# Altium schematic sheet Lan.SchDoc
size A3; SheetNumber: 12; SheetTotal: 22
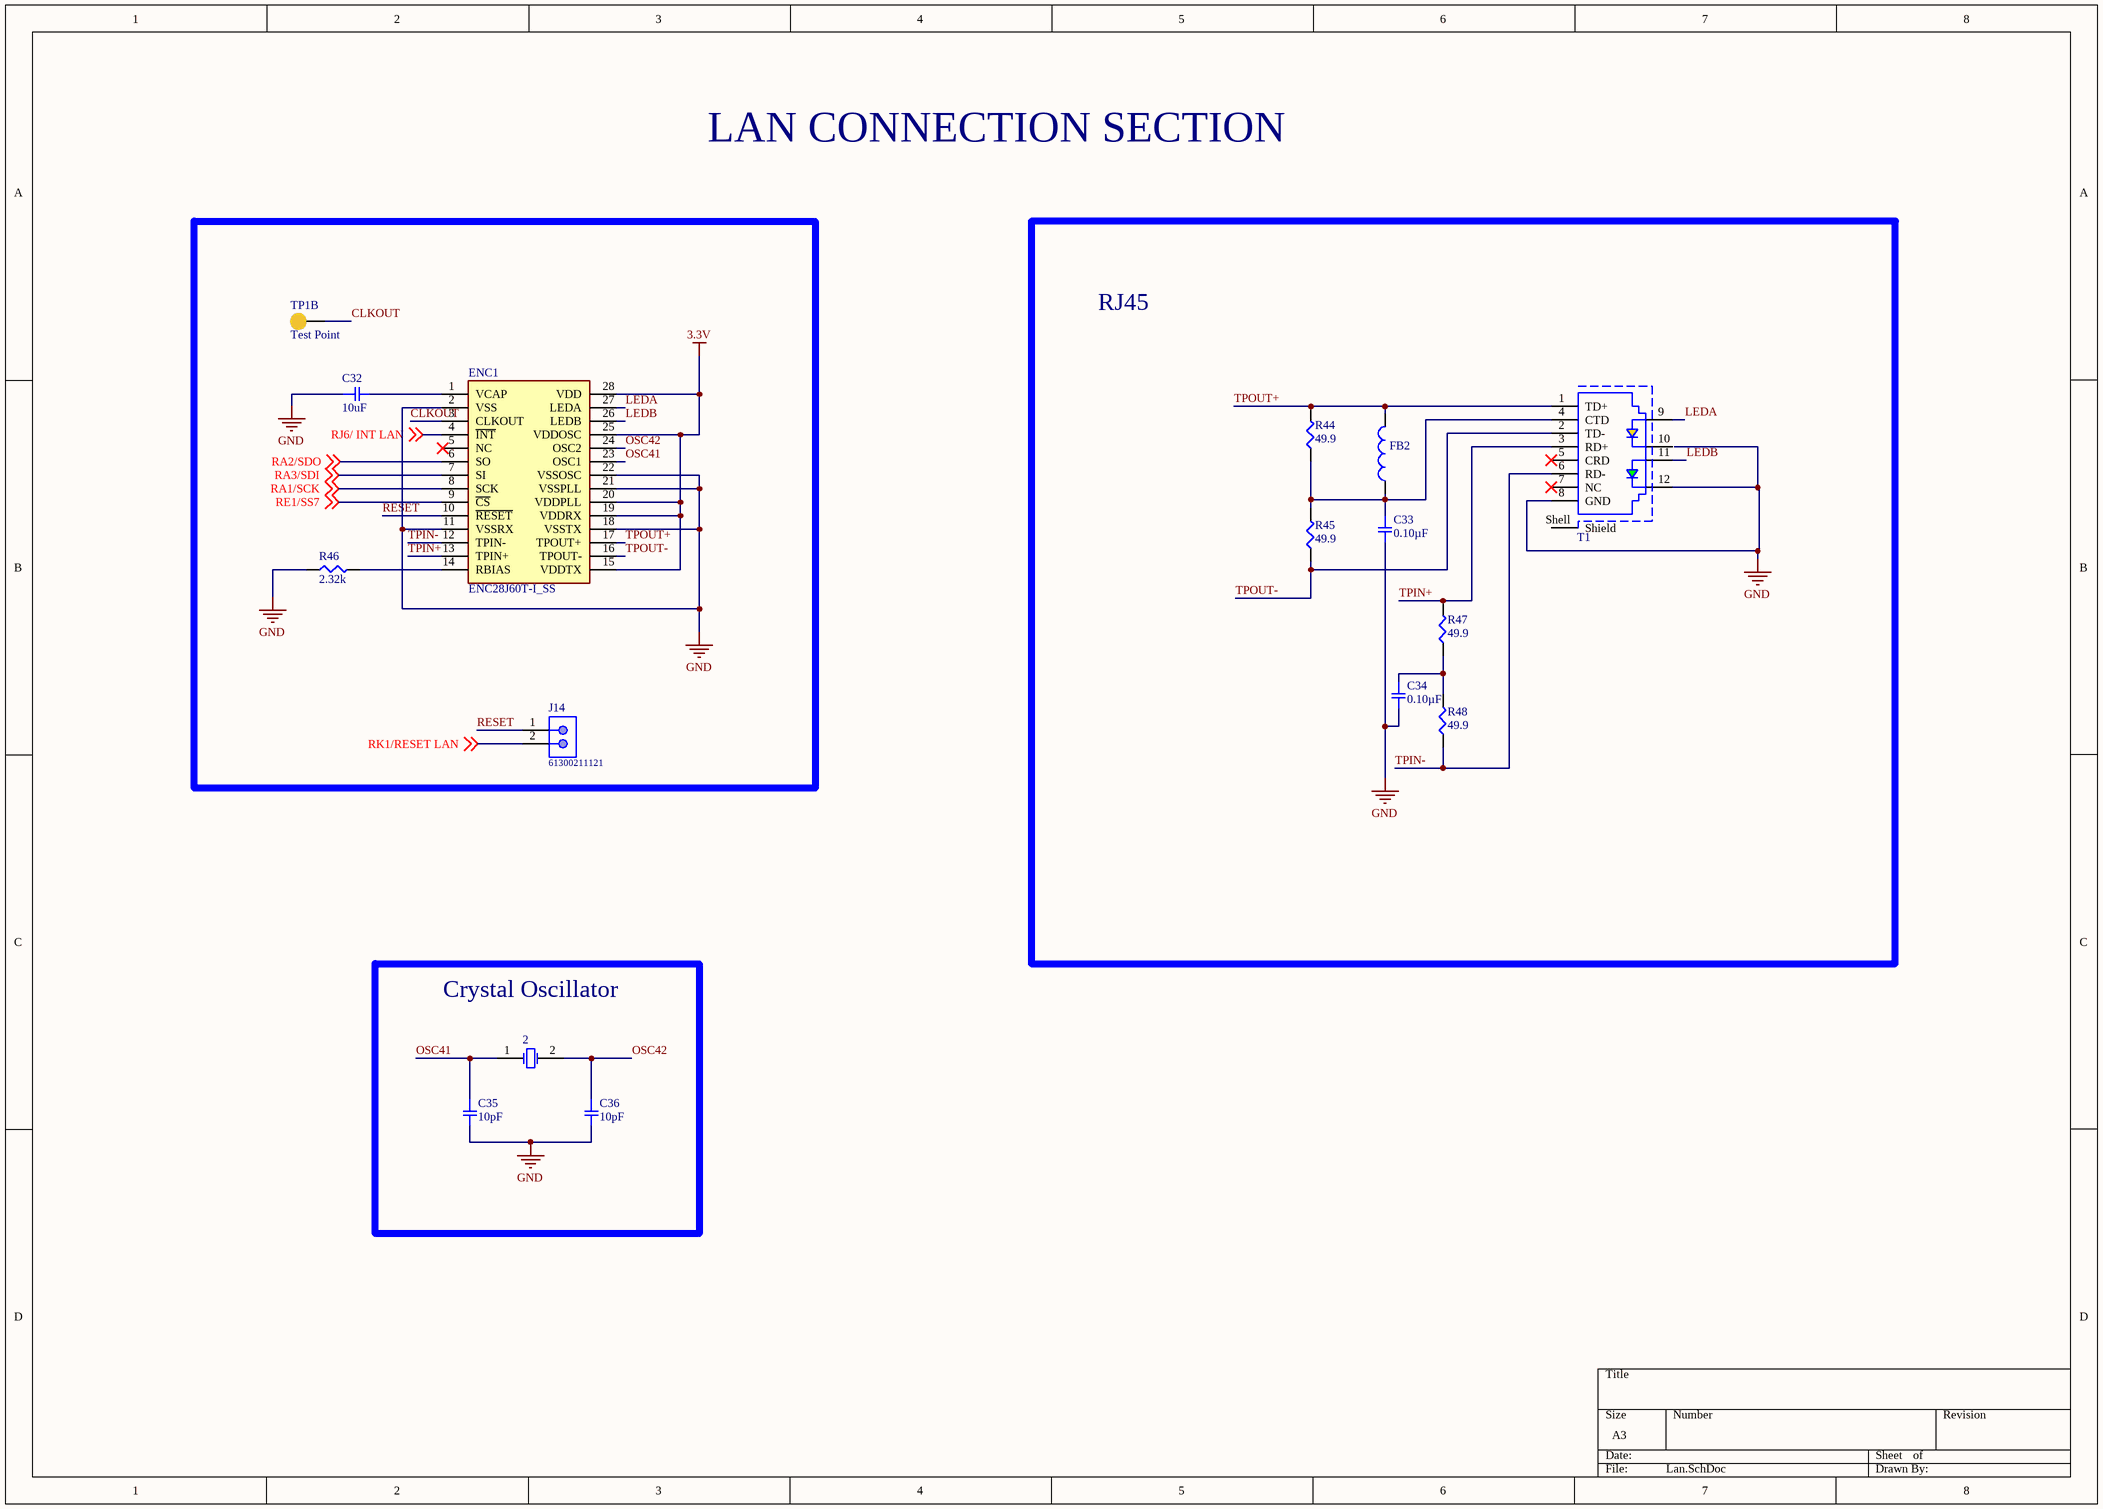
[diagram p0: Lan.SchDoc]

## Parts
2  (no value)  [Mini Crystal]
C32  10uF  [SMD-0805C]
C33  0.10µF  [SMD-0805C]
C34  0.10µF  [SMD-0805C]
C35  10pF  [SMD-0805C]
C36  10pF  [SMD-0805C]
ENC1  ENC28J60T-I_SS  [SOP65P780X200-28N]
FB2  320Ohm  [WE-MPSA_0805_L2W1.2H0.9]  (value not drawn)
J14  61300211121  [61300211121]
R44  49.9  [SMD-0805-RES]
R45  49.9  [SMD-0805-RES]
R46  2.32k  [SMD-0805-RES]
R47  49.9  [SMD-0805-RES]
R48  49.9  [SMD-0805-RES]
T1  ARJM11D7-009-AB-EW2  [74990111211]  (value not drawn)
TP1  Test Point  [pad2]  (part B of 2)

## Blocks framed on the sheet
RJ45: C33 C34 FB2 R44 R45 R47 R48 T1
Crystal Oscillator: 2 C35 C36

## Nets
3.3V: ENC1.15(VDDTX) ENC1.19(VDDRX) ENC1.20(VDDPLL) ENC1.25(VDDOSC) ENC1.28(VDD)
GND: C32.1 C33.2 C34.2 C35.2 C36.2 ENC1.2(VSS) ENC1.11(VSSRX) ENC1.18(VSSTX) ENC1.21(VSSPLL) ENC1.22(VSSOSC) R46.1 T1.8(GND) T1.12
CLKOUT: ENC1.3(CLKOUT) TP1.1
LEDA: ENC1.27(LEDA) T1.9
LEDB: ENC1.26(LEDB) T1.11
OSC41: 2.1(X1) C35.1 ENC1.23(OSC1)
OSC42: 2.2(X2) C36.1 ENC1.24(OSC2)
RA1/SCK: ENC1.8(SCK) ; off-sheet RA1/SCK
RA2/SDO: ENC1.6(SO) ; off-sheet RA2/SDO
RA3/SDI: ENC1.7(SI) ; off-sheet RA3/SDI
RE1/SS7: ENC1.9(~{CS}) ; off-sheet RE1/SS7
RESET: ENC1.10(~{RESET}) J14.1
RJ6/ INT LAN: ENC1.4(~{INT}) ; off-sheet RJ6/ INT LAN
RK1/RESET LAN: J14.2 ; off-sheet RK1/RESET LAN
TPIN+: ENC1.13(TPIN+) R47.2 T1.3(RD+)
TPIN-: ENC1.12(TPIN-) R48.1 T1.6(RD-)
TPOUT+: ENC1.17(TPOUT+) FB2.2 R44.2 T1.1(TD+)
TPOUT-: ENC1.16(TPOUT-) R45.1 T1.2(TD-)
NetC32_2: C32.2 ENC1.1(VCAP)
NetC33_1: C33.1 FB2.1 R44.1 R45.2 T1.4(CTD)
NetC34_1: C34.1 R47.1 R48.2
NetENC1_14: ENC1.14(RBIAS) R46.2

Not connected (* = marked no-connect by the designer): ENC1 5(NC); T1 5(CRD)* 7(NC)* 10 Shell(Shield)

## Notes on the sheet
- LAN CONNECTION SECTION

## Library data of the parts
2 = Mini Crystal: 9B-64.000MBBK-B; Manufacturer: Abracon; PartNumber: ABLS2-4.096MHZ-D4Y-T; Operation Mode: Fundamental or 3rd Overtone; Shunt Capacitance: 7 pF Max.; Freq. Stability: +/- 30 ppm; Packing: Tape and Reel; ESR: 180 Ohm; Load Capacitance: 18 pF; Frequency: 4.096 MHz; Mounting Technology: Surface Mount; PackageDescription: 2-Pin SMD, Body 11.4 x 4.7 mm, Height 3.3 mm; ComponentLink1URL: http://www.abracon.com/; ComponentLink2Description: Datasheet; Operating Temp. Range: -40 to 85 degC; RoHS: TRUE; PackageReference: ABLS2-2; DatasheetVersion: Rev. 03.31.11; Freq. Tolerance: +/- 30 ppm; ComponentLink2URL: http://www.abracon.com/Resonators/ABLS2.pdf; ComponentLink1Description: Manufacturer URL
C32 C35 C36 = GCD21BR71H104KA01L: CAP CER 0.1UF 50V X7R 0805; Manufacturer: Murata Electronics North America; Factory Stock: 0; Unit Price (USD): 0.24; Minimum Quantity: 1; Value: 0.10µF; Tolerance: ±10%; Datasheets: http://www.murata.com/~/media/webrenewal/support/library/catalog/products/capacitor/mlcc/c03e.ashx; Image: //media.digikey.com/Renders/Murata%20Renders/0805%28GxM6%29.jpg; Digi-Key Part Number: 490-11955-1-ND; Part Number: GCD21BR71H104KA01L; Quantity Available: 157; @ qty: 0; Packaging: Cut Tape (CT); Series: GCD; Part Status: Active; Voltage: 50V; Temperature Coefficient: X7R; Operating Temperature: -55°C ~ 125°C; Features: -; Ratings: AEC-Q200; Applications: Automotive; Mounting Type: Surface Mount, MLCC; Package / Case: 0805 (2012 Metric); Size / Dimension: 0.079" L x 0.049" W (2.00mm x 1.25mm); Height - Seated (Max): -; Thickness (Max): 0.049" (1.25mm); Lead Spacing: -; Lead Style: -
C33 C34 = GCD21BR71H104KA01L: CAP CER 0.1UF 50V X7R 0805; Manufacturer: Murata Electronics North America; Factory Stock: 0; Unit Price (USD): 0.24; Minimum Quantity: 1; Tolerance: ±10%; Datasheets: http://www.murata.com/~/media/webrenewal/support/library/catalog/products/capacitor/mlcc/c03e.ashx; Image: //media.digikey.com/Renders/Murata%20Renders/0805%28GxM6%29.jpg; Digi-Key Part Number: 490-11955-1-ND; Part Number: GCD21BR71H104KA01L; Quantity Available: 157; @ qty: 0; Packaging: Cut Tape (CT); Series: GCD; Part Status: Active; Value: 0.10µF; Voltage: 50V; Temperature Coefficient: X7R; Operating Temperature: -55°C ~ 125°C; Features: -; Ratings: AEC-Q200; Applications: Automotive; Mounting Type: Surface Mount, MLCC; Package / Case: 0805 (2012 Metric); Size / Dimension: 0.079" L x 0.049" W (2.00mm x 1.25mm); Height - Seated (Max): -; Thickness (Max): 0.049" (1.25mm); Lead Spacing: -; Lead Style: -
ENC1 = ENC28J60T-I_SS: Integrated Circuit; Manufacturer_Name: Microchip; Manufacturer_Part_Number: ENC28J60T-I/SS; Datasheet Link: https://mouser.componentsearchengine.com/Datasheets/2/ENC28J60T-I_SS.pdf; Height: 2mm; Mouser Part Number: 579-ENC28J60T-I/SS; Mouser Price/Stock: https://www.mouser.co.uk/ProductDetail/Microchip-Technology/ENC28J60T-I-SS?qs=0swJU7D5CoWRYqX2omYpJQ%3D%3D; Arrow Part Number: ENC28J60T-I/SS; Arrow Price/Stock: https://www.arrow.com/en/products/enc28j60t-iss/microchip-technology?region=nac
FB2 = 78279220321: WE-MPSA EMI Multilayer Power Suppresion Bead, size 0805, 320Ohm, 2.5A; Manufacturer: Wurth Elektronik; Case/Size Code: 0805; DC Resistance: 50mOhm; Impedance Max: 347Ohm; Type: High Current; Manufacturer Part Number: 78279220321; Category: Ferrites for PCB Assembly; Match Code: WE-MPSA; ComponentLink1Description: Website Link; ComponentLink1URL: https://www.we-online.com/redexpert/article/78279220321?ad; ComponentLink2Description: Datasheet Link; ComponentLink2URL: https://www.we-online.com/redexpert/spec/78279220321?ad; Mount: Surface Mount; Operating Temperature Max: 125°C; Operating Temperature Min: -55°C; Packaging: Tape and Reel; Length: 2mm; Width: 1.2mm; Height: 0.9mm; Automotive: Yes; Impedance @100MHz: 320Ohm; Rated Current: 2.5A; ComponentLink3Description: digikey; ComponentLink3URL: https://www.digikey.in/en/products/detail/laird-signal-integrity-products/MI0805L301R-10/806630
J14 = 61300211121: WR-PHD Pin Header, THT, pitch 2.54mm, Single Row, Vertical, 2pin; Pin Number: 2; Gender: Male; Rated Current: 3A; Working Voltage: 250VAC; Withstanding Voltage: 500VAC; Contact Resistance: 20mOhm; ComponentLink1Description: Manufacturer; ComponentLink1URL: http://www.we-online.de; ComponentLink2Description: Datasheet; ComponentLink2URL: https://katalog.we-online.de/em/datasheet/6130xx11121.pdf; Part Number: 61300211121; Published Date: June 2019; Publisher: Wurth Elektronik; Pitch: 2.54mm; Operating Temperature: -40 to +105degC; Mounting Technology: THT; Packaging: Bag; Row Number: Single; Orientation: Vertical
R44 R45 R47 R48 = ERJ-6ENF49R9V: RES SMD 49.9 OHM 1% 1/8W 0805; Manufacturer: Panasonic Electronic Components; Factory Stock: 0; Unit Price (USD): 0.00729; @ qty: 1500; Minimum Quantity: 1; Power (Watts): 0.125W, 1/8W; Temperature Coefficient: ±100ppm/°C; Part Number: ERJ-6ENF49R9V; Datasheets: http://industrial.panasonic.com/www-cgi/jvcr13pz.cgi?E+PZ+3+AOA0002+ERJ6ENF49R9V+7+WW; Image: //media.digikey.com/Renders/Panasonic%20Renders/ERJ-0805%20Pkg.jpg; Digi-Key Part Number: P49.9CCT-ND; Quantity Available: 574999; Packaging: Cut Tape (CT); Series: ERJ; Part Status: Active; Value: 49.9; Tolerance: ±1%; Composition: Thick Film; Features: Automotive AEC-Q200; Operating Temperature: -55°C ~ 155°C; Package / Case: 0805 (2012 Metric); Supplier Device Package: 0805; Size / Dimension: 0.079" L x 0.049" W (2.00mm x 1.25mm); Height - Seated (Max): 0.028" (0.70mm); Number of Terminations: 2; Failure Rate: -
R46 = ERJ-6ENF2321V: RES SMD 2.32K OHM 1% 1/8W 0805; Manufacturer: Panasonic Electronic Components; Factory Stock: 0; Unit Price (USD): 0.00729; @ qty: 1500; Minimum Quantity: 1; Power (Watts): 0.125W, 1/8W; Temperature Coefficient: ±100ppm/°C; Part Number: ERJ-6ENF2321V; Datasheets: http://industrial.panasonic.com/www-cgi/jvcr13pz.cgi?E+PZ+3+AOA0002+ERJ6ENF2321V+7+WW; Image: //media.digikey.com/Renders/Panasonic%20Renders/ERJ-0805%20Pkg.jpg; Digi-Key Part Number: P2.32KCCT-ND; Quantity Available: 67004; Packaging: Cut Tape (CT); Series: ERJ; Part Status: Active; Value: 2.32k; Tolerance: ±1%; Composition: Thick Film; Features: Automotive AEC-Q200; Operating Temperature: -55°C ~ 155°C; Package / Case: 0805 (2012 Metric); Supplier Device Package: 0805; Size / Dimension: 0.079" L x 0.049" W (2.00mm x 1.25mm); Height - Seated (Max): 0.028" (0.70mm); Number of Terminations: 2; Failure Rate: -
T1 = 74990111211: WE-RJ45 LAN Transformer, THT, 1 Port, 10/100 Base-T, Tab Down; Manufacturer: Wurth Elektronik; LED: yellow-green; Number of Ports: 1; PoE: non-PoE; Shield Tabs: Yes; USB: No USB; Manufacturer Part Number: 74990111211; Category: Filtered Connectors; Match Code: WE-RJ45 LAN; ComponentLink1Description: Website Link; ComponentLink1URL: https://www.we-online.com/redexpert/article/74990111211?ad; ComponentLink2Description: Datasheet Link; ComponentLink2URL: https://www.we-online.com/redexpert/spec/74990111211?ad; Mount: Through Hole; Operating Temperature Max: 85°C; Operating Temperature Min: -40°C; Packaging: Tube; Length: 21.84mm; Width: 15.88mm; Height: 13.95mm; Data Rate: 10/100 Base-T; Tab: Down; ComponentLink3Description: Digikey Link; ComponentLink3URL: https://www.digikey.in/en/products/detail/abracon-llc/ARJM11D7-009-AB-EW2/7675229
TP1 = pad2: Top Testpoint Pad